# EAGLE schematic Pot_Input (EAGLE 9.6.2)
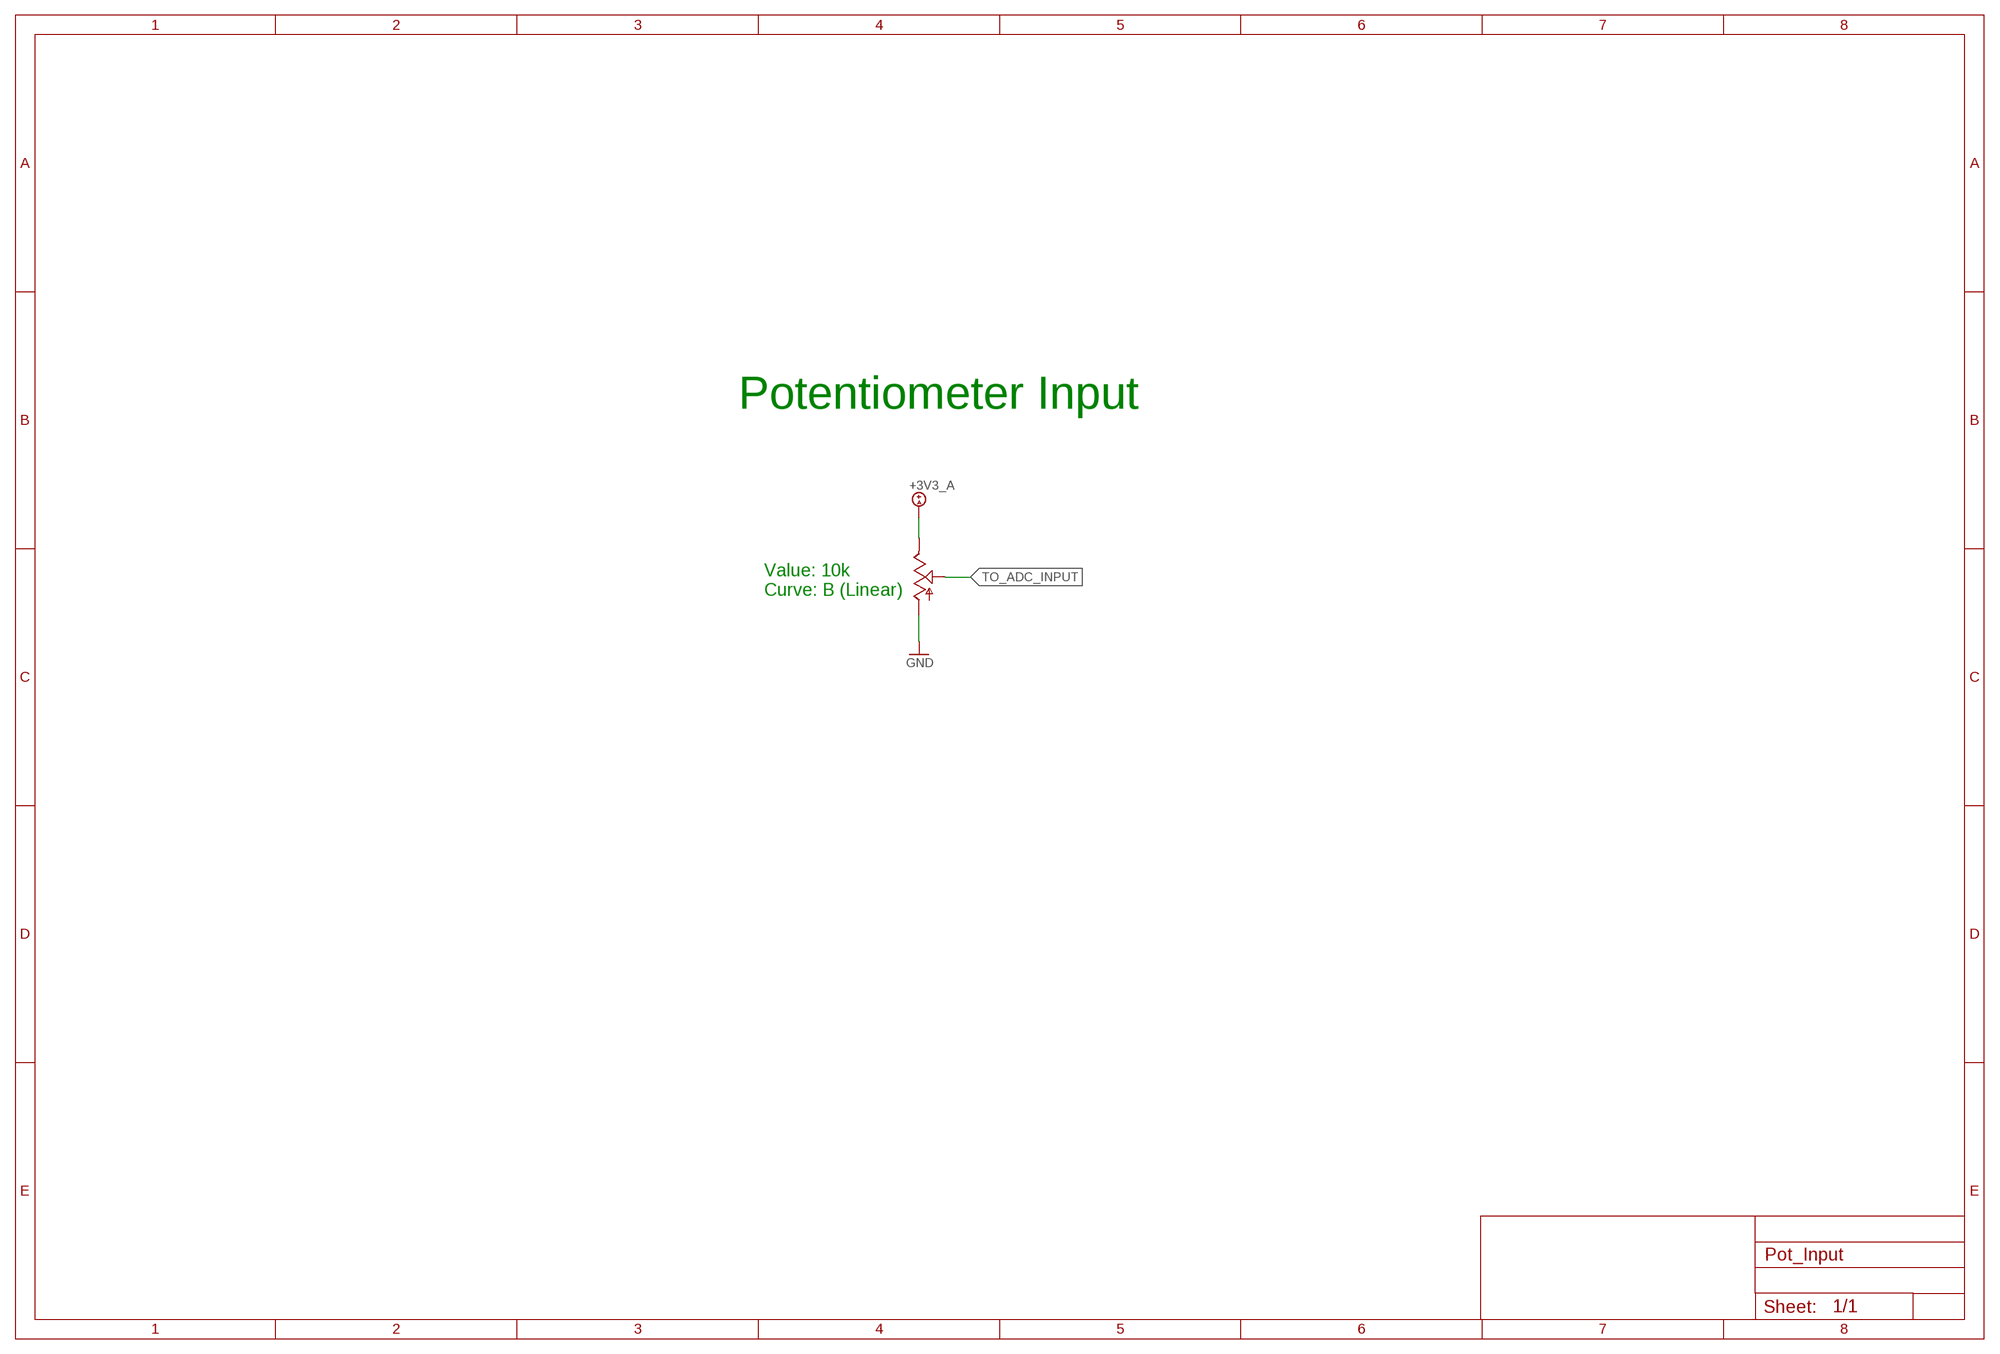
[diagram p0: schematic, sheet 1]

## Parts
VR1  POT_9MM_SNAP-IN__  [9MM_SNAP-IN_POT_SILK]

## Nets
+3V3_A: VR1.3
GND: VR1.1
TO_ADC_INPUT: VR1.2

## Notes on the sheet
- Potentiometer Input
- Value: 10k
  Curve: B (Linear)

## Library data of the parts
VR1 = Electrosmith-Interface:POT_9MM_SNAP-IN_: 9mm vertical snap-in pot, Alpha / Panasonic style

## Net classes
0 default: width 0.203 mm